# EasyEDA Pro project EasyEDAPro-Schematic.epro, board iButton
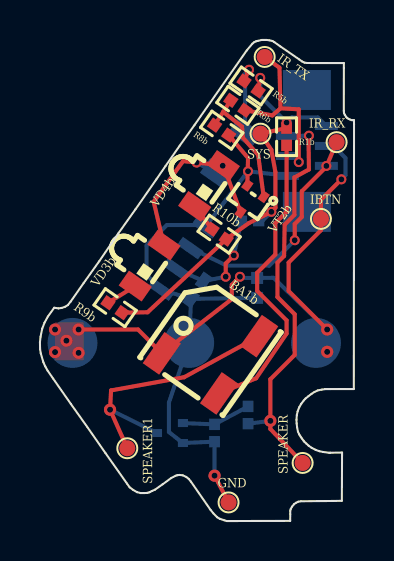
[diagram p8: board, top side]
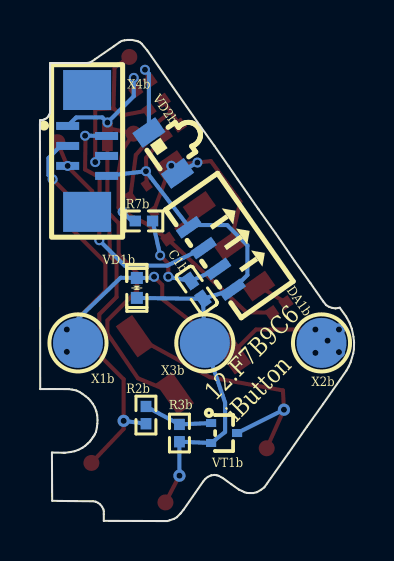
[diagram p9: board, bottom side, seen from below]

Outline 15.73 x 24.08 mm; copper layers: Top Layer, Bottom Layer. Coordinates in mm from the lower left corner of the outline.
Outline path: 0,8.95 0.03,9.22 0.11,9.63 0.23,9.93 0.4,10.24 0.72,10.68 0.93,10.64 1.1,10.67 1.26,10.73 1.39,10.81 1.54,10.99 2.19,11.91 2.97,13.01 3.92,14.39 4.79,15.61 5.83,17.1 6.29,17.77 7,18.79 7.75,19.84 10.35,23.56 10.63,23.9 10.73,23.98 10.81,24.01 10.9,24.04 11.1,24.08 11.22,24.08 11.34,24.08 11.49,24.07 11.64,24.03 11.73,23.98 12.03,23.77 12.98,23.11 13.13,23.01 13.25,22.95 13.39,22.93 15.16,22.93 15.22,22.93 15.22,22.69 15.21,20.53 15.22,20.43 15.26,20.34 15.33,20.24 15.39,20.17 15.46,20.13 15.54,20.1 15.62,20.07 15.71,20.07 15.72,20.06 15.73,19.87 15.71,6.61 15.07,6.61 14.28,6.61 14.11,6.58 13.91,6.54 13.74,6.46 13.6,6.37 13.44,6.25 13.3,6.14 13.21,6.03 13.08,5.87 12.98,5.7 12.9,5.49 12.86,5.31 12.84,5.06 12.85,4.89 12.88,4.69 12.92,4.47 12.99,4.33 13.05,4.22 13.11,4.14 13.2,4.03 13.24,3.96 13.33,3.88 13.46,3.77 13.6,3.67 13.8,3.57 13.99,3.5 14.18,3.46 14.47,3.42 14.54,3.42 15.13,3.43 15.12,1.01 14.73,1.01 13.06,0.99 12.93,0.97 12.83,0.92 12.72,0.84 12.62,0.72 12.55,0.59 12.53,0.5 12.53,0.35 12.53,0.01 9.35,0 9.23,0.04 9,0.11 8.88,0.19 8.69,0.38 8.54,0.56 7.56,1.98 7.45,2.11 7.33,2.21 7.15,2.29 6.99,2.31 6.87,2.29 6.78,2.26 6.57,2.16 6.14,1.84 5.76,1.57 5.6,1.5 5.49,1.44 5.39,1.41 5.3,1.4 5.04,1.4 4.86,1.45 4.67,1.56 4.49,1.69 4.36,1.87 3.28,3.41 2.36,4.72 1.55,5.86 0.66,7.13 0.38,7.53 0.27,7.74 0.17,7.95 0.04,8.4 0.01,8.6 0,8.95
Stack: Top Layer 0.035mm - / Dielectric1 0.71mm FR4 er 4.5 / Bottom Layer 0.035mm -

## Design rules (mm)
template: JLCPCB Capability(Two Layers Board)
spacing copperThickness1oz (default): track to track 0.102, other pairs 0.152 to 0.3
spacing copperThickness2oz: track to track 0.203, other pairs 0.152 to 0.3
track width copperThickness1oz (default): min 0.127, default 0.254, max 2.54
track width copperThickness2oz: min 0.203, default 0.254, max 2.54
differential pair differentialPair (default): width min 0.127, default 0.254, max 2.54; gap min 0.152, default 0.152
via viaSize (default): diameter min 0.5, default 0.61, max 10; hole min 0.3, default 0.305, max 6.3

## Placement (name value [footprint] x y rotation side)
BA1b  SMD-5025-0340-12Ω  [BUZ-SMD_3P-L5.0-W5.0-BL]  8.54 8.83 55 top
C1b  4.7uF  [C0402]  7.88 11.57 55 bottom
DA1b  IRM-V838M3-C/TR1  [OPTO-SMD_IRM-V838M3-C-TR1]  7.17 13.14 55 bottom
GND  -  [测试点0.8mm]  9.44 0.93 0 top
IBTN  -  [测试点0.8mm]  14.07 15.13 0 top
IR_RX  -  [测试点0.8mm]  14.85 18.97 0 top
IR_TX  -  [测试点0.8mm]  11.25 23.23 0 top
R1b  22Ω  [R0402]  12.35 19.24 90 top
R2b  10kΩ  [R0402]  10.42 5.31 90 bottom
R3b  10kΩ  [R0402]  8.74 4.41 90 bottom
R5b  43Ω  [R0402]  10.57 21.78 325 top
R6b  150Ω  [R0402]  9.91 20.81 145 top
R7b  150Ω  [R0402]  10.52 15.02 0 bottom
R8b  10kΩ  [R0402]  9.1 19.57 145 top
R9b  43Ω  [R0402]  3.76 10.68 325 top
R10b  43Ω  [R0402]  8.97 14.36 325 top
SPEAKER  -  [测试点0.8mm]  13.15 2.91 90 top
SPEAKER1  -  [测试点0.8mm]  4.37 3.64 0 top
SYS  -  [测试点0.8mm]  11.04 19.39 0 top
VD1b  AU0561M1S  [D0402-BI]  10.88 11.67 270 bottom
VD2b  IR26-51C/L110/TR8  [OPTO-SMD_L3.0-W2.6_IR26-51C-L110-TR8]  9.56 18.43 235 bottom
VD3b  IR26-51C/L110/TR8  [OPTO-SMD_L3.0-W2.6_IR26-51C-L110-TR8]  5.49 12.79 55 top
VD4b  IR26-51C/L110/TR8  [OPTO-SMD_L3.0-W2.6_IR26-51C-L110-TR8]  8.46 16.78 55 top
VT1b  DMN313DLT-7  [SOT-523-3_L1.6-W0.8-P1.00-LS1.6-BR]  6.51 4.41 0 bottom
VT2b  DMN313DLT-7  [SOT-523-3_L1.6-W0.8-P1.00-LS1.6-BR]  10.42 15.99 55 top
X1b  KH-PG2010005-DZ  [SMD-1_BD2.0-H10.0]  13.82 8.92 180 bottom
X2b  KH-PG2010005-DZ  [SMD-1_BD2.0-H10.0]  1.63 8.92 180 bottom
X3b  KH-PG2010005-DZ  [SMD-1_BD2.0-H10.0]  7.47 8.92 180 bottom
X4b  AFC11-S06ICC-00  [FPC-SMD_6P-P0.50_AFC11-S06ICC-00]  13.37 18.53 270 bottom

## Footprints (pads in the part's own frame, mm; a bottom-side part is the same pattern mirrored in y, then rotated)
BUZ-SMD_3P-L5.0-W5.0-BL
  rect 1.9x1 smd: 1(-1.75,-1.75) 2(1.75,-1.75) 3(-1.75,1.75)
C0402
  rect 0.79x0.54 smd: 1(-0.545,0) 2(0.545,0)
D0402-BI
  rect 0.6x0.6 smd: 1(-0.5,0) 2(0.5,0)
FPC-SMD_6P-P0.50_AFC11-S06ICC-00
  rect 0.4x1.15 smd: 1(-1.25,-0.975) 2(-0.75,0.975) 3(-0.25,-0.975) 4(0.25,0.975) 5(0.75,-0.975) 6(1.25,0.975)
  rect 2x2.4 smd: 7(3.05,0) 8(-3.05,0)
OPTO-SMD_IRM-V838M3-C-TR1
  rect 0.5x1.27 smd: 1(-1.905,0) 2(-0.635,0) 3(0.635,0) 4(1.905,0)
OPTO-SMD_L3.0-W2.6_IR26-51C-L110-TR8
  rect 0.9x1.4 smd: 1(-1.25,0) 2(1.25,0)
R0402
  rect 0.566x0.54 smd: 1(-0.433,0) 2(0.433,0)
SMD-1_BD2.0-H10.0
  round 2.5 smd: 1(0,0)
SOT-523-3_L1.6-W0.8-P1.00-LS1.6-BR
  rect 0.51x0.4 smd: 1(0.65,-0.5) 2(0.65,0.5) 3(-0.65,0)
测试点0.8mm
  round 0.8 smd: 1(0,0)

## Nets
As in the schematic.

Pads without a net: X4b 7 8

## Via types
v1: diameter 0.61, hole 0.305, Top Layer to Bottom Layer, 10 vias
v2: diameter 0.5, hole 0.3, Top Layer to Bottom Layer, 15 vias

## Routing (per net, layer and track width the routed paths; a pad name or vN(x,y) marks a point on that pad's centre or on a via; arc(x,y) is an arc through that point)
GND: length 31.7
  Top Layer w0.203: GND.1 v1(8.74,2.27) ; 10.38,16.81 10.42,18.17 R8b.1
  Bottom Layer w0.203: C1b.1 X3b.1 6.46,5.93 6.46,4.46 VT1b.2 R3b.1 v1(8.74,2.27) ; C1b.1 6.08,11.58 5.34,12.32 5.34,13.8 6.36,14.82 8.14,14.82 DA1b.4 v2(10.42,17.51) X4b.6 ; C1b.1 VD1b.2
SYS: length 21.5
  Top Layer w0.203: R1b.2 SYS.1 11.59,18.58 11.79,17.46 11.79,15.68 v2(11.59,15.48) ; v2(11.59,15.48) 10.47,14.92 R10b.2 5.39,10.45 R9b.2 ; v2(11.59,15.48) 11.49,15.38 ; v2(11.03,22.19) R5b.2
  Bottom Layer w0.203: X4b.1 13.91,20.2 12.6,20.2 v2(12.35,19.95) 11.03,21.27 v2(11.03,22.19) ; 10.95,15.02 11.13,15.02 v2(11.59,15.48)
$1N343: length 20.7
  Top Layer w0.203: SPEAKER.1 11.54,4.61 v1(11.54,5.02) 11.54,7.1 12.76,8.32 12.76,10.35 11.89,11.21 11.89,12.94 12.22,13.27 12.25,14.84 12.74,15.33 12.74,17.2 13.47,17.6 13.45,19.14
  Bottom Layer w0.203: X4b.2 v2(13.47,19.29) ; R2b.1 v1(11.54,5.02)
$1N565: length 3.5
  Bottom Layer w0.203: 10.42,5.74 R3b.2 VT1b.1
$1N1085: length 9.1
  Top Layer w0.203: 12.04,20.66 11.64,20.31 R6b.1 ; 12.04,20.66 12.96,20.61 v2(12.96,17.97) ; 12.04,20.66 11.99,22.69 IR_TX.1
  Bottom Layer w0.203: X4b.4 12.65,18.28 v2(12.96,17.97)
$1N1228: length 6.5
  Top Layer w0.203: 9.18,20.48 10.11,19.75 10.17,19.19 10.93,18.33 11.2,16.23 ; 9.18,20.48 R8b.2 ; 9.18,20.48 R6b.2
$1N1390: length 10.4
  Top Layer w0.203: VT2b.3 9.18,17.8 v2(7.84,17.95) 7.17,18.02 5.69,15.99 6.21,13.81
  Bottom Layer w0.203: VD2b.2 v2(7.84,17.95)
  vias: v2(9.15,17.79)
$1N1470: length 3.8
  Top Layer w0.203: v2(10.47,22.59) R5b.1
  Bottom Layer w0.203: v2(10.47,22.59) 10.27,22.39 VD2b.1
$1N1509: length 1.6
  Top Layer w0.203: R9b.1 VD3b.1
$1N1548: length 1.4
  Top Layer w0.203: VD4b.1 R10b.1
$1N1606: length 11.6
  Top Layer w0.203: 14.34,17.74 13.11,16.51 13.11,15.23 12.76,14.87 v2(12.76,14.06) ; 14.34,17.74 IR_RX.1 ; 14.34,17.74 14.33,17.72
  Bottom Layer w0.203: v2(12.76,14.06) 11.49,12.79 9.35,12.79 DA1b.3
  vias: v2(14.34,17.78)
$1N1617: length 5.6
  Top Layer w0.203: v2(9.3,12.23) 9.3,12.89 v2(9.71,13.3)
  Bottom Layer w0.203: v2(9.71,13.3) R7b.1 ; v2(9.3,12.23) C1b.2 DA1b.2
$1N2115: length 15.4
  Top Layer w0.203: R1b.1 12.35,15.48 11.79,14.92 11.79,13.34 10.88,12.43 10.88,11.52 12.35,10.05 12.35,9.38 10.83,7.15 BA1b.1
$1N2118: length 13.7
  Top Layer w0.203: BA1b.2 7.22,7.2 3.56,6.54 v1(3.51,5.57) SPEAKER1.1
  Bottom Layer w0.203: 5.86,4.41 v1(3.51,5.57)
$1N2122: length 27.6
  Top Layer w0.203: v2(15.09,17.11) 14.07,16.08 IBTN.1 14.07,14.56 12.45,12.94 12.45,11.52 v1(14.38,9.59) ; v1(1.94,9.59) 4.91,9.59 BA1b.3 9.61,11.11 9.61,11.82 v2(10.01,12.23)
  Bottom Layer w0.203: v2(15.09,17.11) 15.3,17.31 15.3,18.17 14.69,18.78 X4b.3 ; v2(10.01,12.23) 10.07,12.17 VD1b.1 11.69,12.18 v1(14.38,9.59)
  vias: v1(0.76,9.59) v1(0.76,8.46) v1(1.33,9.03) v1(1.94,8.42) v1(14.38,8.47)

## Copper pours and planes (outline as drawn; the poured copper is in the pictures)
$1N2122 on Top Layer: 0.76,9.94 2.19,9.94 2.19,8.05 0.76,8.05

## Text on the board
Bottom Silkscreen Layer: 12.F7B9C6 / iButton
